# EAGLE schematic 足回りtwelite (EAGLE 9.6.2)
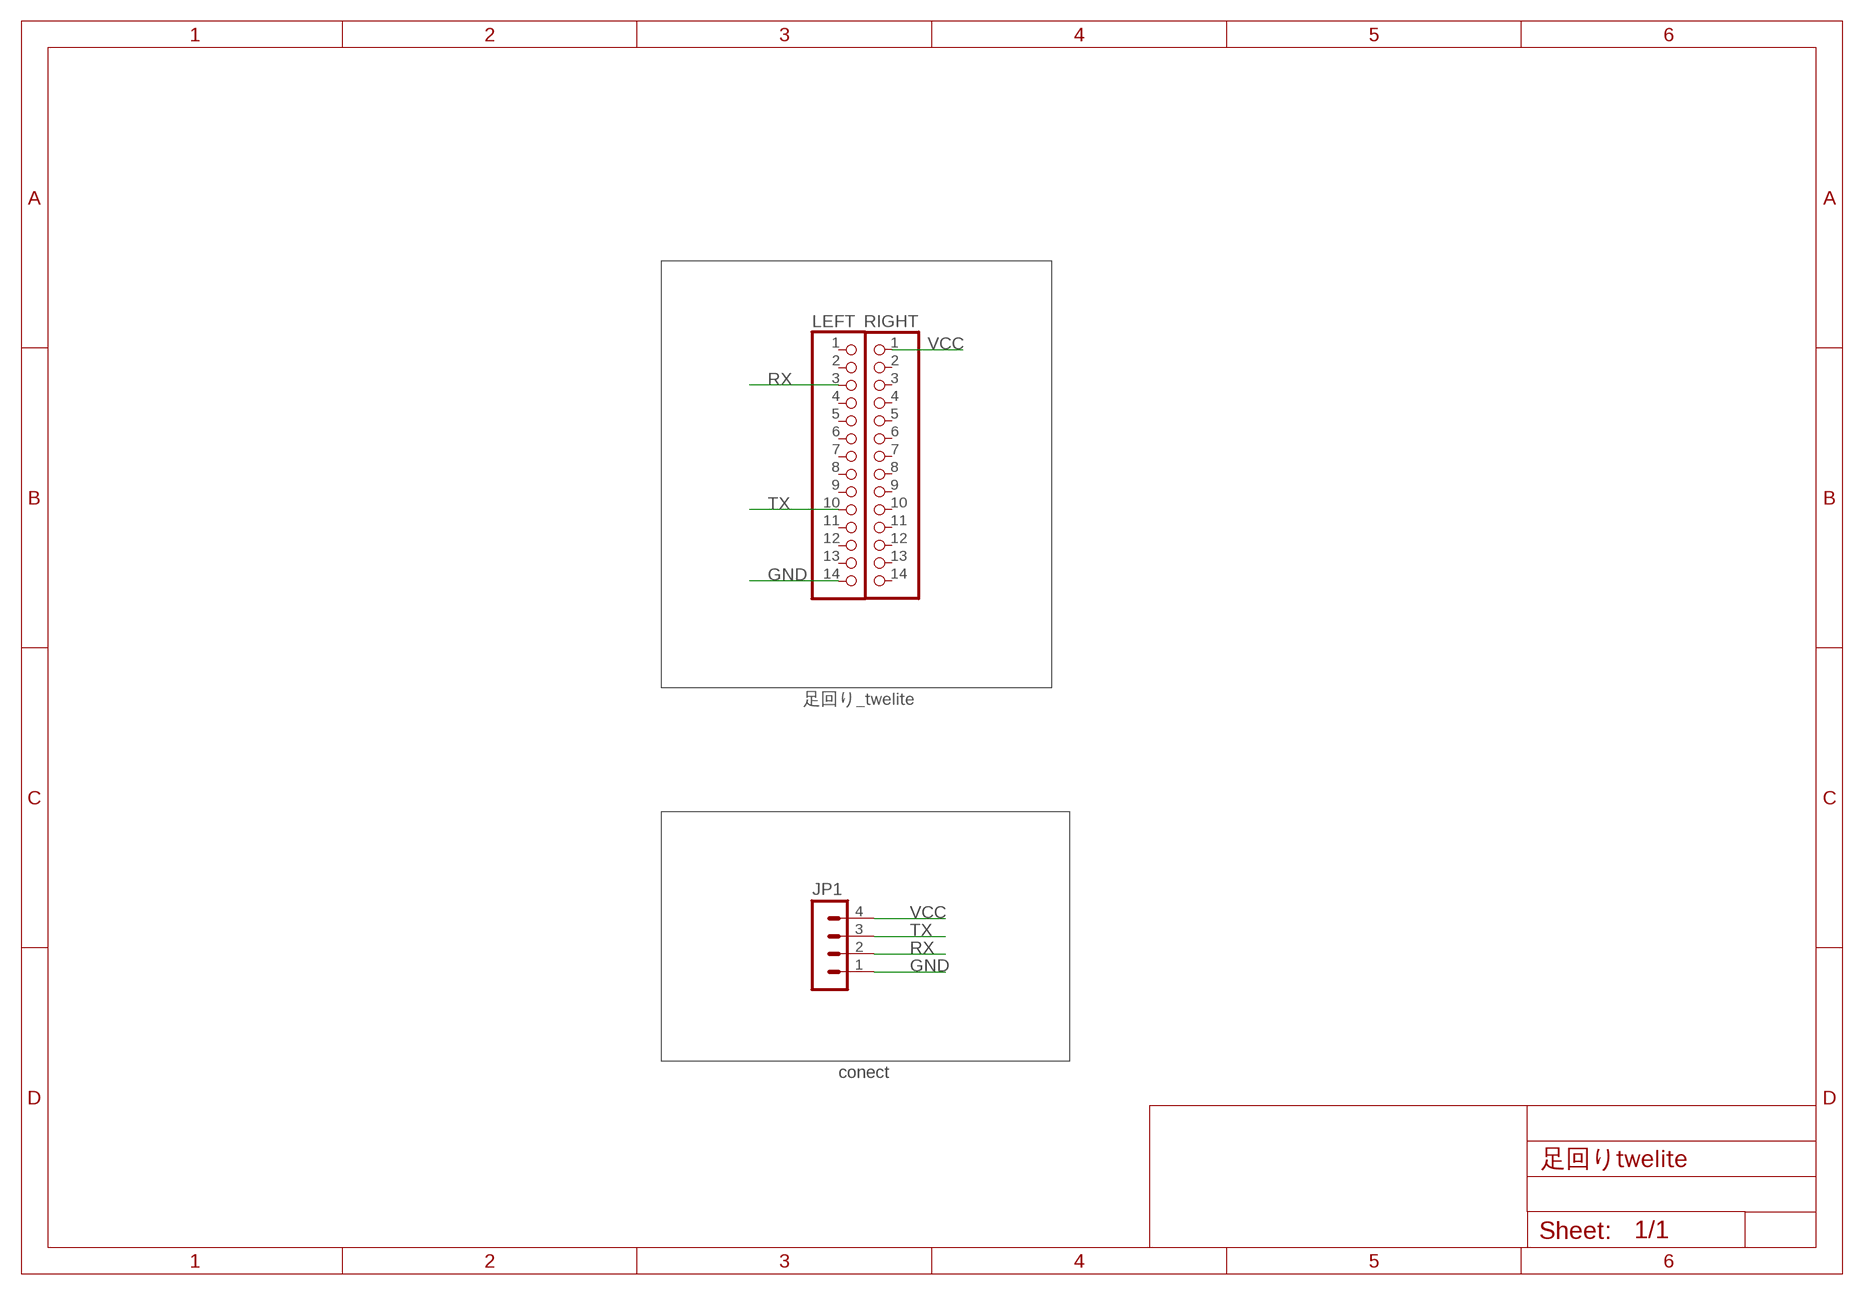
[diagram p0: schematic, sheet 1]

## Parts
JP1  04-JST  [B4B-XH]
LEFT  PINHD-1X14  [1X14]
RIGHT  PINHD-1X14  [1X14]

## Nets
GND: JP1.1 LEFT.14
RX: JP1.2 LEFT.3
TX: JP1.3 LEFT.10
VCC: JP1.4 RIGHT.1
Unconnected: LEFT.1 LEFT.2 LEFT.4 LEFT.5 LEFT.6 LEFT.7 LEFT.8 LEFT.9 LEFT.11 LEFT.12 LEFT.13 RIGHT.2 RIGHT.3 RIGHT.4 RIGHT.5 RIGHT.6 RIGHT.7 RIGHT.8 RIGHT.9 RIGHT.10 RIGHT.11 RIGHT.12 RIGHT.13 RIGHT.14

## Notes on the sheet
- 足回り_twelite
- conect

## Library data of the parts
JP1 = con-jst-xh (1):04-JST: JST CONNECTOR
LEFT RIGHT = pinhead:PINHD-1X14: PIN HEADER